# Altium schematic sheet Backpanel.SchDoc
size A4; Organization: UltraZohm; SheetNumber: 37
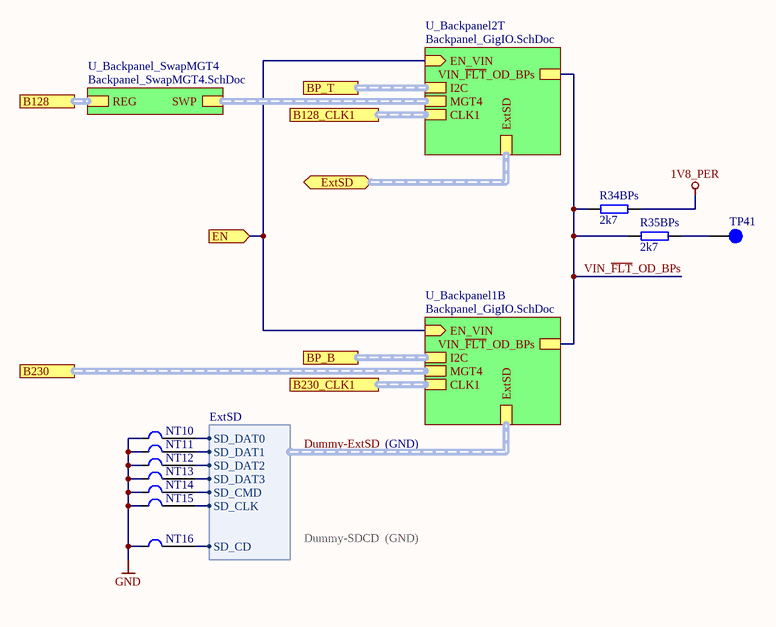
[diagram p0: Backpanel.SchDoc]

## Parts
NT10  Net Tie 1 to 1  [1_to_1_NetTie_0.1mm]  (value not drawn)  (net tie, no BOM)
NT11  Net Tie 1 to 1  [1_to_1_NetTie_0.1mm]  (value not drawn)  (net tie, no BOM)
NT12  Net Tie 1 to 1  [1_to_1_NetTie_0.1mm]  (value not drawn)  (net tie, no BOM)
NT13  Net Tie 1 to 1  [1_to_1_NetTie_0.1mm]  (value not drawn)  (net tie, no BOM)
NT14  Net Tie 1 to 1  [1_to_1_NetTie_0.1mm]  (value not drawn)  (net tie, no BOM)
NT15  Net Tie 1 to 1  [1_to_1_NetTie_0.1mm]  (value not drawn)  (net tie, no BOM)
NT16  Net Tie 1 to 1  [1_to_1_NetTie_0.1mm]  (value not drawn)  (net tie, no BOM)
R34BPs  2k7  [R_0603_TE]
R35BPs  2k7  [R_0603_TE]
TP41  Testpoint 1mm  [TP_1mm]  (value not drawn)  (no BOM)

## Sub-sheets
U_Backpanel1B = Backpanel_GigIO.SchDoc: EN_VIN (in), I2C (harness I2C), MGT4 (harness MGT4), CLK1 (harness MGTCLK), VIN_~{FLT}_OD_BPs, ExtSD (harness ExtSD)
U_Backpanel2T = Backpanel_GigIO.SchDoc: EN_VIN (in), I2C (harness I2C), MGT4 (harness MGT4), CLK1 (harness MGTCLK), VIN_~{FLT}_OD_BPs, ExtSD (harness ExtSD)
U_Backpanel_SwapMGT4 = Backpanel_SwapMGT4.SchDoc: REG (harness MGT4), SWP (harness MGT4)

## Ports
B128 (harness MGT4), B128_CLK1 (harness MGTCLK), B230 (harness MGT4), B230_CLK1 (harness MGTCLK), BP_B (harness I2C), BP_T (harness I2C), EN (in), ExtSD (bidir, harness ExtSD)

## Harnesses
ExtSD: SD_DAT0, SD_DAT1, SD_DAT2, SD_DAT3, SD_CMD, SD_CLK, SD_CD

## Nets
1V8_PER: R34BPs.2
GND: NT10.1 NT11.1 NT12.1 NT13.1 NT14.1 NT15.1 NT16.1
Dummy-ExtSD.SD_CD: NT16.2 ; sheet U_Backpanel1B/ExtSD.SD_CD
Dummy-ExtSD.SD_CLK: NT15.2 ; sheet U_Backpanel1B/ExtSD.SD_CLK
Dummy-ExtSD.SD_CMD: NT14.2 ; sheet U_Backpanel1B/ExtSD.SD_CMD
Dummy-ExtSD.SD_DAT0: NT10.2 ; sheet U_Backpanel1B/ExtSD.SD_DAT0
Dummy-ExtSD.SD_DAT1: NT11.2 ; sheet U_Backpanel1B/ExtSD.SD_DAT1
Dummy-ExtSD.SD_DAT2: NT12.2 ; sheet U_Backpanel1B/ExtSD.SD_DAT2
Dummy-ExtSD.SD_DAT3: NT13.2 ; sheet U_Backpanel1B/ExtSD.SD_DAT3
EN: port EN, sheet U_Backpanel2T/EN_VIN, sheet U_Backpanel1B/EN_VIN
VIN_~{FLT}_OD_BPs: R34BPs.1 R35BPs.1 ; sheet U_Backpanel2T/VIN_~{FLT}_OD_BPs, sheet U_Backpanel1B/VIN_~{FLT}_OD_BPs
NetR35BPs_2: R35BPs.2 TP41.1

## Buses and harness runs
harness Dummy-ExtSD = sheet U_Backpanel1B/ExtSD
harness port B128 = sheet U_Backpanel_SwapMGT4/REG
harness port B128_CLK1 = sheet U_Backpanel2T/CLK1
harness port B230 = sheet U_Backpanel1B/MGT4
harness port B230_CLK1 = sheet U_Backpanel1B/CLK1
harness port BP_B = sheet U_Backpanel1B/I2C
harness port BP_T = sheet U_Backpanel2T/I2C
harness port ExtSD = sheet U_Backpanel2T/ExtSD
harness sheet U_Backpanel2T/MGT4 = sheet U_Backpanel_SwapMGT4/SWP

## Notes on the sheet
- (GND)
- Dummy-SDCD
- Title
- Revision:
- Design Engineer:
- Date:
- Project:
- Sheet
- of

## Library data of the parts
NT10-NT16 = Net Tie 1 to 1: Net Tie 1 to 1. Joins two nets without producing a DRC error or renaming one of the nets; PartID: 2; Created On: 29/09/2024 15:25:00; Component Type: Net Tie 1 to 1; Last Updated: 29/09/2024 15:25:00; Type: Net Tie (No BOM); Created by: MGeier; Live Cycle Status: 1
R34BPs R35BPs = UZgen_R_0603_2k7: Generic resistor; Manufacturer: UZgen; Tolerance: 1 %; Created from: UZgenTool; Manufacturer Part Number: UZgen_R_0603_2k7; PartID: 231; Created On: 02/07/2024 17:29:49; Value: 2k7; Device Package: 0603; Mounting Type: SMD; Last Updated: 02/07/2024 17:29:49
TP41 = NULL: Manufacturer Part Number: NULL; Created from: AGeiger; Created: 2018_06_25_AGeiger; Value: Testpoint 1mm; PartID: 9; Created On: 20/09/2022 13:14:57; Component Type: Testpoint; Last Updated: 20/09/2022 13:15:39; Manufacturer: NULL; Supplier 1: NULL; Supplier Part Number 1: NULL; Type: Testpoint; Live Cycle Status: 1